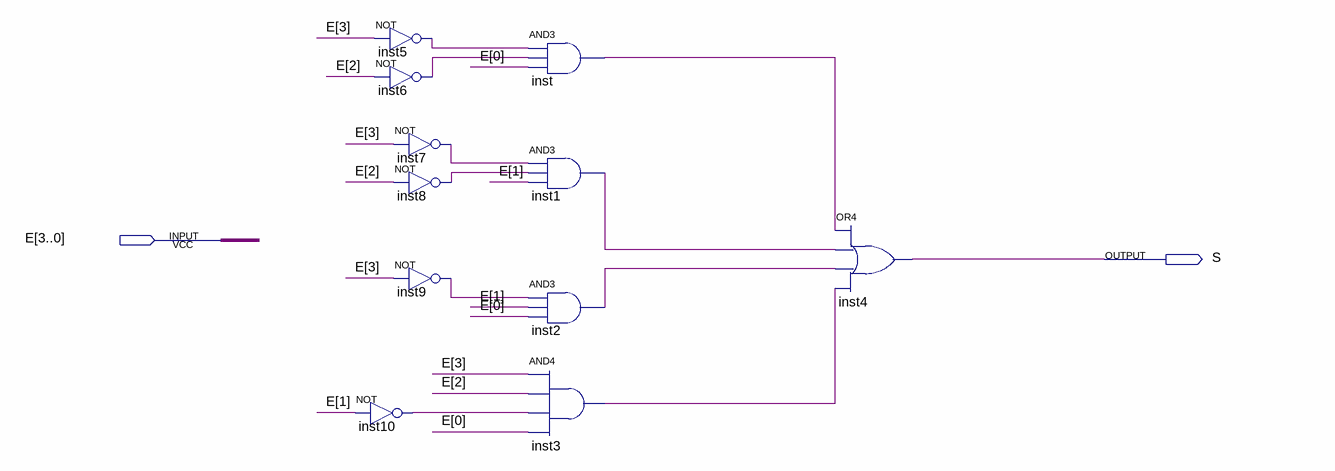
[diagram p0: schematic sheet]
// Quartus schematic segmentof.bdf as structural Verilog: 11 symbols, 2 pins
module segmentof (
  input  [3:0] E,
  output S
);

  wire inst1_out, inst2_out, inst3_out, inst5_out, inst6_out, inst7_out, inst8_out, inst9_out, inst10_out,
       inst_out;

  not inst5 (inst5_out, E[3]);
  not inst6 (inst6_out, E[2]);
  not inst7 (inst7_out, E[3]);
  not inst8 (inst8_out, E[2]);
  not inst9 (inst9_out, E[3]);
  not inst10 (inst10_out, E[1]);
  and inst (inst_out, inst5_out, inst6_out, E[0]);
  and inst1 (inst1_out, inst7_out, inst8_out, E[1]);
  and inst2 (inst2_out, inst9_out, E[1], E[0]);
  and inst3 (inst3_out, E[3], E[2], inst10_out, E[0]);
  or inst4 (S, inst_out, inst1_out, inst2_out, inst3_out);
endmodule
